# Altium schematic sheet TopLevel.SchDoc
size A4; SheetNumber: 1; SheetTotal: 5
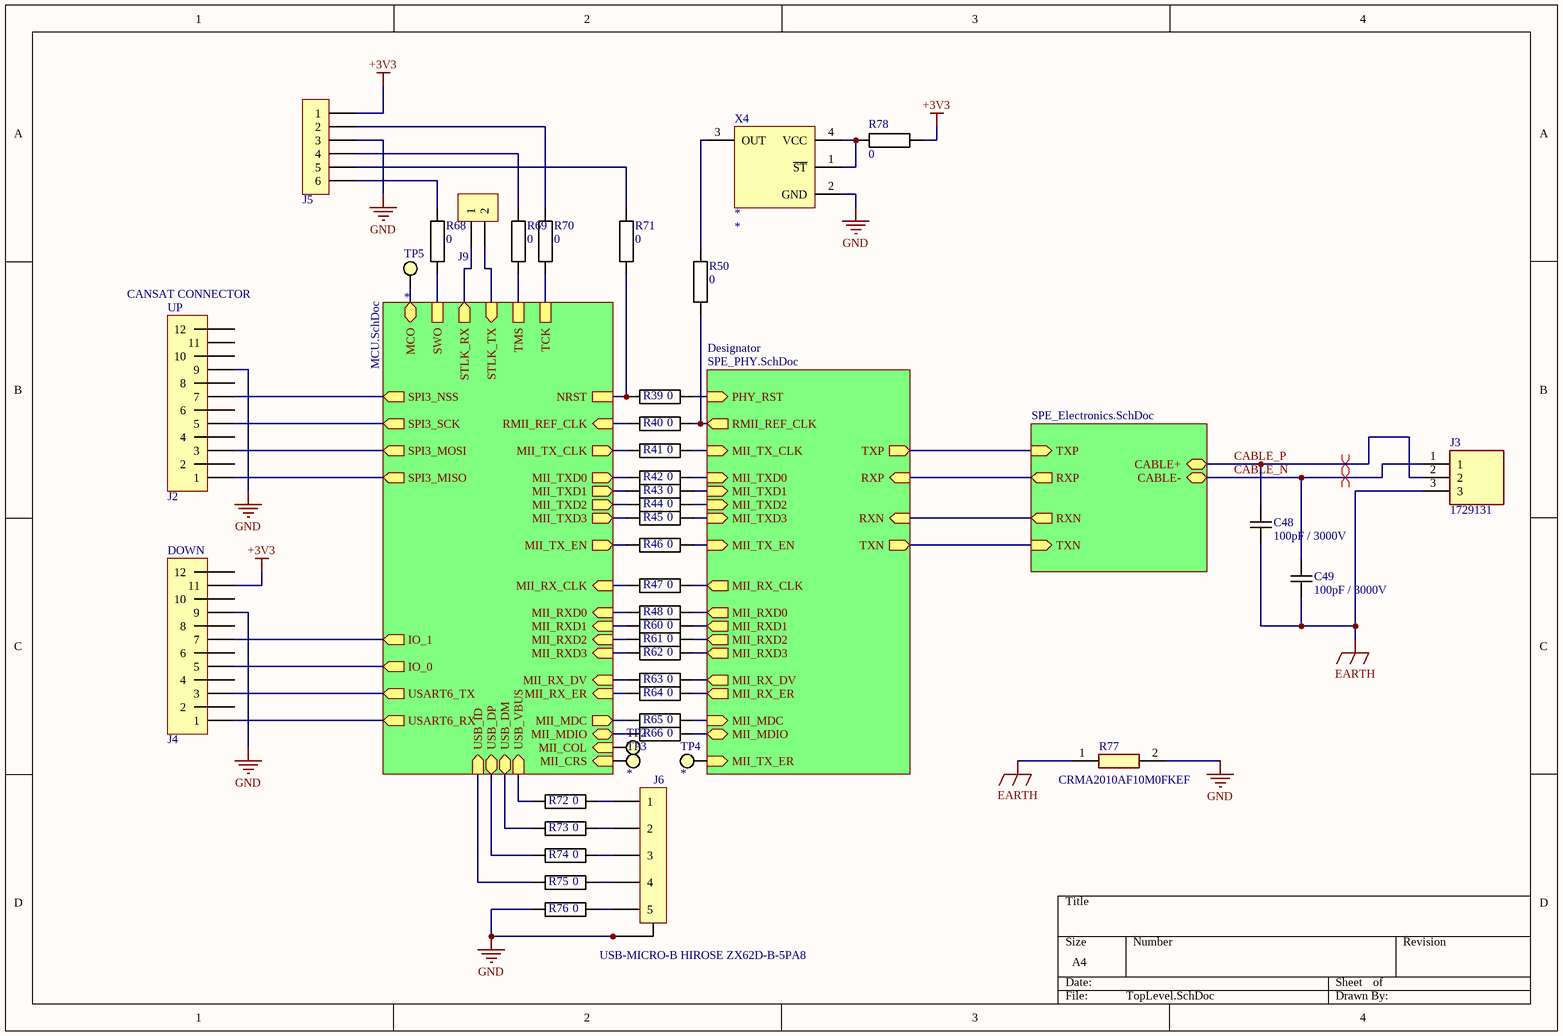
[diagram p0: TopLevel.SchDoc]

## Parts
C48  100pF / 3000V  [CAPACITOR 4520 REFLOW]
C49  100pF / 3000V  [CAPACITOR 4520 REFLOW]
J2  *  [PINHEADER2X6 P2.54 SIDE MOUNT]  (value not drawn)
J3  1729131  [1729131]
J4  *  [PINHEADER2X6 P2.54 SIDE MOUNT]  (value not drawn)
J5  *  [PinHeader1x6 P2.54]  (value not drawn)
J6  USB-MICRO-B HIROSE ZX62D-B-5PA8  [USB-MICRO-B HIROSE ZX62D-B-5PA8]
J9  *  [PinHeader1x2 P2.54]  (value not drawn)
R39  0  [RESISTOR 1608 REFLOW]
R40  0  [RESISTOR 1608 REFLOW]
R41  0  [RESISTOR 1608 REFLOW]
R42  0  [RESISTOR 1608 REFLOW]
R43  0  [RESISTOR 1608 REFLOW]
R44  0  [RESISTOR 1608 REFLOW]
R45  0  [RESISTOR 1608 REFLOW]
R46  0  [RESISTOR 1608 REFLOW]
R47  0  [RESISTOR 1608 REFLOW]
R48  0  [RESISTOR 1608 REFLOW]
R50  0  [RESISTOR 1608 REFLOW]
R60  0  [RESISTOR 1608 REFLOW]
R61  0  [RESISTOR 1608 REFLOW]
R62  0  [RESISTOR 1608 REFLOW]
R63  0  [RESISTOR 1608 REFLOW]
R64  0  [RESISTOR 1608 REFLOW]
R65  0  [RESISTOR 1608 REFLOW]
R66  0  [RESISTOR 1608 REFLOW]
R68  0  [RESISTOR 1608 REFLOW]
R69  0  [RESISTOR 1608 REFLOW]
R70  0  [RESISTOR 1608 REFLOW]
R71  0  [RESISTOR 1608 REFLOW]
R72  0  [RESISTOR 1005 REFLOW]
R73  0  [RESISTOR 1005 REFLOW]
R74  0  [RESISTOR 1005 REFLOW]
R75  0  [RESISTOR 1005 REFLOW]
R76  0  [RESISTOR 1005 REFLOW]
R77  CRMA2010AF10M0FKEF  [RESC5125X74N]
R78  0  [RESISTOR 1608 REFLOW]
TP2  *  [Pad D0.8]  (no BOM)
TP3  *  [Pad D0.8]  (no BOM)
TP4  *  [Pad D0.8]  (no BOM)
TP5  *  [Pad D0.8]  (no BOM)
X4  *  [Oscillator C2.5x2 Seiko Epson SPXO SG-210STF]

## Sub-sheets
Designator = MCU.SchDoc: NRST, USB_DM (bidir), TCK, RMII_REF_CLK (in), USB_VBUS (in), USB_ID (in), USART6_TX (out), TMS, STLK_TX (in), USB_DP (bidir), STLK_RX (out), SWO, USART6_RX (out), MCO (bidir), MII_TX_EN (out), MII_TX_CLK (out), MII_TXD3 (out), MII_RX_ER (in), MII_RXD0 (in), MII_RXD3 (in), MII_CRS (in), MII_RX_CLK (in), MII_RXD1 (in), MII_RX_DV (in), MII_MDIO (bidir), MII_TXD2 (out), MII_TXD0 (out), MII_MDC (out), MII_RXD2 (in), MII_TXD1 (out), MII_COL (in), SPI3_SCK (out), SPI3_MOSI (out), SPI3_NSS (out), IO_1 (out), IO_0 (out), SPI3_MISO (out)
Designator = SPE_Electronics.SchDoc: RXP (out), TXN (in), CABLE+ (bidir), CABLE- (bidir), TXP (in), RXN (out)
Designator = SPE_PHY.SchDoc: RXN (in), TXP (out), PHY_RST (in), RMII_REF_CLK (out), RXP (in), TXN (out), MII_RXD1 (out), MII_TX_ER (in), MII_RX_ER (out), MII_TX_CLK (in), MII_RXD3 (out), MII_MDIO (bidir), MII_TXD1 (in), MII_RX_DV (out), MII_TX_EN (in), MII_MDC (in), MII_RX_CLK (out), MII_RXD0 (out), MII_RXD2 (out), MII_TXD0 (in), MII_TXD3 (in), MII_TXD2 (in)

## Nets
+3V3: J4.11 J5.1 R78.2
EARTH: C48.2 C49.2 J3.3 R77.1
GND: J2.9 J4.9 J5.3 J6.6 J6.7 J6.8 J6.9 R76.2 R77.2 X4.2(GND)
CABLE_N: C49.1 J3.1 ; sheet Designator/CABLE-
CABLE_P: C48.1 J3.2 ; sheet Designator/CABLE+
NetJ2_1: J2.1 ; sheet Designator/SPI3_MISO
NetJ2_3: J2.3 ; sheet Designator/SPI3_MOSI
NetJ2_5: J2.5 ; sheet Designator/SPI3_SCK
NetJ2_7: J2.7 ; sheet Designator/SPI3_NSS
NetJ4_1: J4.1 ; sheet Designator/USART6_RX
NetJ4_3: J4.3 ; sheet Designator/USART6_TX
NetJ4_5: J4.5 ; sheet Designator/IO_0
NetJ4_7: J4.7 ; sheet Designator/IO_1
NetJ5_2: J5.2 R70.1
NetJ5_4: J5.4 R69.1
NetJ5_5: J5.5 R71.1
NetJ5_6: J5.6 R68.1
NetJ6_1: J6.1 R72.1
NetJ6_2: J6.2 R73.1
NetJ6_3: J6.3 R74.1
NetJ6_4: J6.4 R75.1
NetJ6_5: J6.5 R76.1
NetJ9_1: J9.1 ; sheet Designator/STLK_RX
NetJ9_2: J9.2 ; sheet Designator/STLK_TX
NetR39_1: R39.1 ; sheet Designator/PHY_RST
NetR39_2: R39.2 R71.2 ; sheet Designator/NRST
NetR40_1: R40.1 R50.2 ; sheet Designator/RMII_REF_CLK
NetR40_2: R40.2 ; sheet Designator/RMII_REF_CLK
NetR41_1: R41.1 ; sheet Designator/MII_TX_CLK
NetR41_2: R41.2 ; sheet Designator/MII_TX_CLK
NetR42_1: R42.1 ; sheet Designator/MII_TXD0
NetR42_2: R42.2 ; sheet Designator/MII_TXD0
NetR43_1: R43.1 ; sheet Designator/MII_TXD1
NetR43_2: R43.2 ; sheet Designator/MII_TXD1
NetR44_1: R44.1 ; sheet Designator/MII_TXD2
NetR44_2: R44.2 ; sheet Designator/MII_TXD2
NetR45_1: R45.1 ; sheet Designator/MII_TXD3
NetR45_2: R45.2 ; sheet Designator/MII_TXD3
NetR46_1: R46.1 ; sheet Designator/MII_TX_EN
NetR46_2: R46.2 ; sheet Designator/MII_TX_EN
NetR47_1: R47.1 ; sheet Designator/MII_RX_CLK
NetR47_2: R47.2 ; sheet Designator/MII_RX_CLK
NetR48_1: R48.1 ; sheet Designator/MII_RXD0
NetR48_2: R48.2 ; sheet Designator/MII_RXD0
NetR50_1: R50.1 X4.3(OUT)
NetR60_1: R60.1 ; sheet Designator/MII_RXD1
NetR60_2: R60.2 ; sheet Designator/MII_RXD1
NetR61_1: R61.1 ; sheet Designator/MII_RXD2
NetR61_2: R61.2 ; sheet Designator/MII_RXD2
NetR62_1: R62.1 ; sheet Designator/MII_RXD3
NetR62_2: R62.2 ; sheet Designator/MII_RXD3
NetR63_1: R63.1 ; sheet Designator/MII_RX_DV
NetR63_2: R63.2 ; sheet Designator/MII_RX_DV
NetR64_1: R64.1 ; sheet Designator/MII_RX_ER
NetR64_2: R64.2 ; sheet Designator/MII_RX_ER
NetR65_1: R65.1 ; sheet Designator/MII_MDC
NetR65_2: R65.2 ; sheet Designator/MII_MDC
NetR66_1: R66.1 ; sheet Designator/MII_MDIO
NetR66_2: R66.2 ; sheet Designator/MII_MDIO
NetR68_2: R68.2 ; sheet Designator/SWO
NetR69_2: R69.2 ; sheet Designator/TMS
NetR70_2: R70.2 ; sheet Designator/TCK
NetR72_2: R72.2 ; sheet Designator/USB_VBUS
NetR73_2: R73.2 ; sheet Designator/USB_DM
NetR74_2: R74.2 ; sheet Designator/USB_DP
NetR75_2: R75.2 ; sheet Designator/USB_ID
NetR78_1: R78.1 X4.1(~{ST}) X4.4(VCC)
NetTP2_1: TP2.1 ; sheet Designator/MII_COL
NetTP3_1: TP3.1 ; sheet Designator/MII_CRS
NetTP4_1: TP4.1 ; sheet Designator/MII_TX_ER
NetTP5_1: TP5.1 ; sheet Designator/MCO
(unnamed): sheet Designator/RXP, sheet Designator/RXP
(unnamed): sheet Designator/TXN, sheet Designator/TXN
(unnamed): sheet Designator/TXP, sheet Designator/TXP
(unnamed): sheet Designator/RXN, sheet Designator/RXN

Not connected (* = marked no-connect by the designer): J2 2 4 6 8 10 11 12; J4 2 4 6 8 10 12

## Layout directives
differential pair: CABLE_N, CABLE_P

## Notes on the sheet
- (near J2) CANSAT CONNECTOR
- (near J2) UP
- (near J4) DOWN

## Library data of the parts
C48 C49 = Capacitor: Value: 100pF / 3000V
J2 J4 = PinHeader2x6: Plug connector; Value: *
J3 = 1729131: Connector; Manufacturer_Name: Phoenix Contact; Datasheet Link: http://www.phoenixcontact.com/de/produkte/1729131/pdf; Height: 10.15mm; Manufacturer_Part_Number: 1729131; Mouser Part Number: 651-1729131; Mouser Price/Stock: https://www.mouser.co.uk/ProductDetail/Phoenix-Contact/1729131?qs=GFUSqQMLmmkspw%2F%2FW6PC3g%3D%3D; Arrow Part Number: 1729131; Arrow Price/Stock: https://www.arrow.com/en/products/1729131/phoenix-contact
J5 = PinHeader1x6: Plug connector; Value: *
J9 = PinHeader1x2: Plug connector; Value: *
R39-R48 R50 R60-R66 R68-R76 R78 = Resistor: Value: 0
R77 = CRMA2010AF1K00FKEF: Resistor; Manufacturer_Name: Vishay; Datasheet Link: https://www.vishay.com/docs/68043/crma.pdf; Height: 0.74mm; Manufacturer_Part_Number: CRMA2010AF1K00FKEF; Mouser Part Number: 71-CRMA2010AF1K00FKF; Mouser Price/Stock: https://www.mouser.co.uk/ProductDetail/Vishay-Techno/CRMA2010AF1K00FKEF?qs=1mbolxNpo8fLEeNjiEgpoA%3D%3D; Arrow Part Number: CRMA2010AF1K00FKEF; Arrow Price/Stock: https://www.arrow.com/en/products/crma2010af1k00fkef/vishay
TP2-TP5 = Pad: Value: *
X4 = Oscillator C2.5x2.0 Seiko Epson SPXO SG-210STF: Oscillator C2.5x2 Seiko Epson SPXO SG-210STF; Value: *